# Altium schematic sheet RAM.SchDoc
size A3; SheetNumber: 9; SheetTotal: 14; SPICEModelCachePWQIORAL: <root> / <DocumentId>PWQIORAL</DocumentId> / </root>
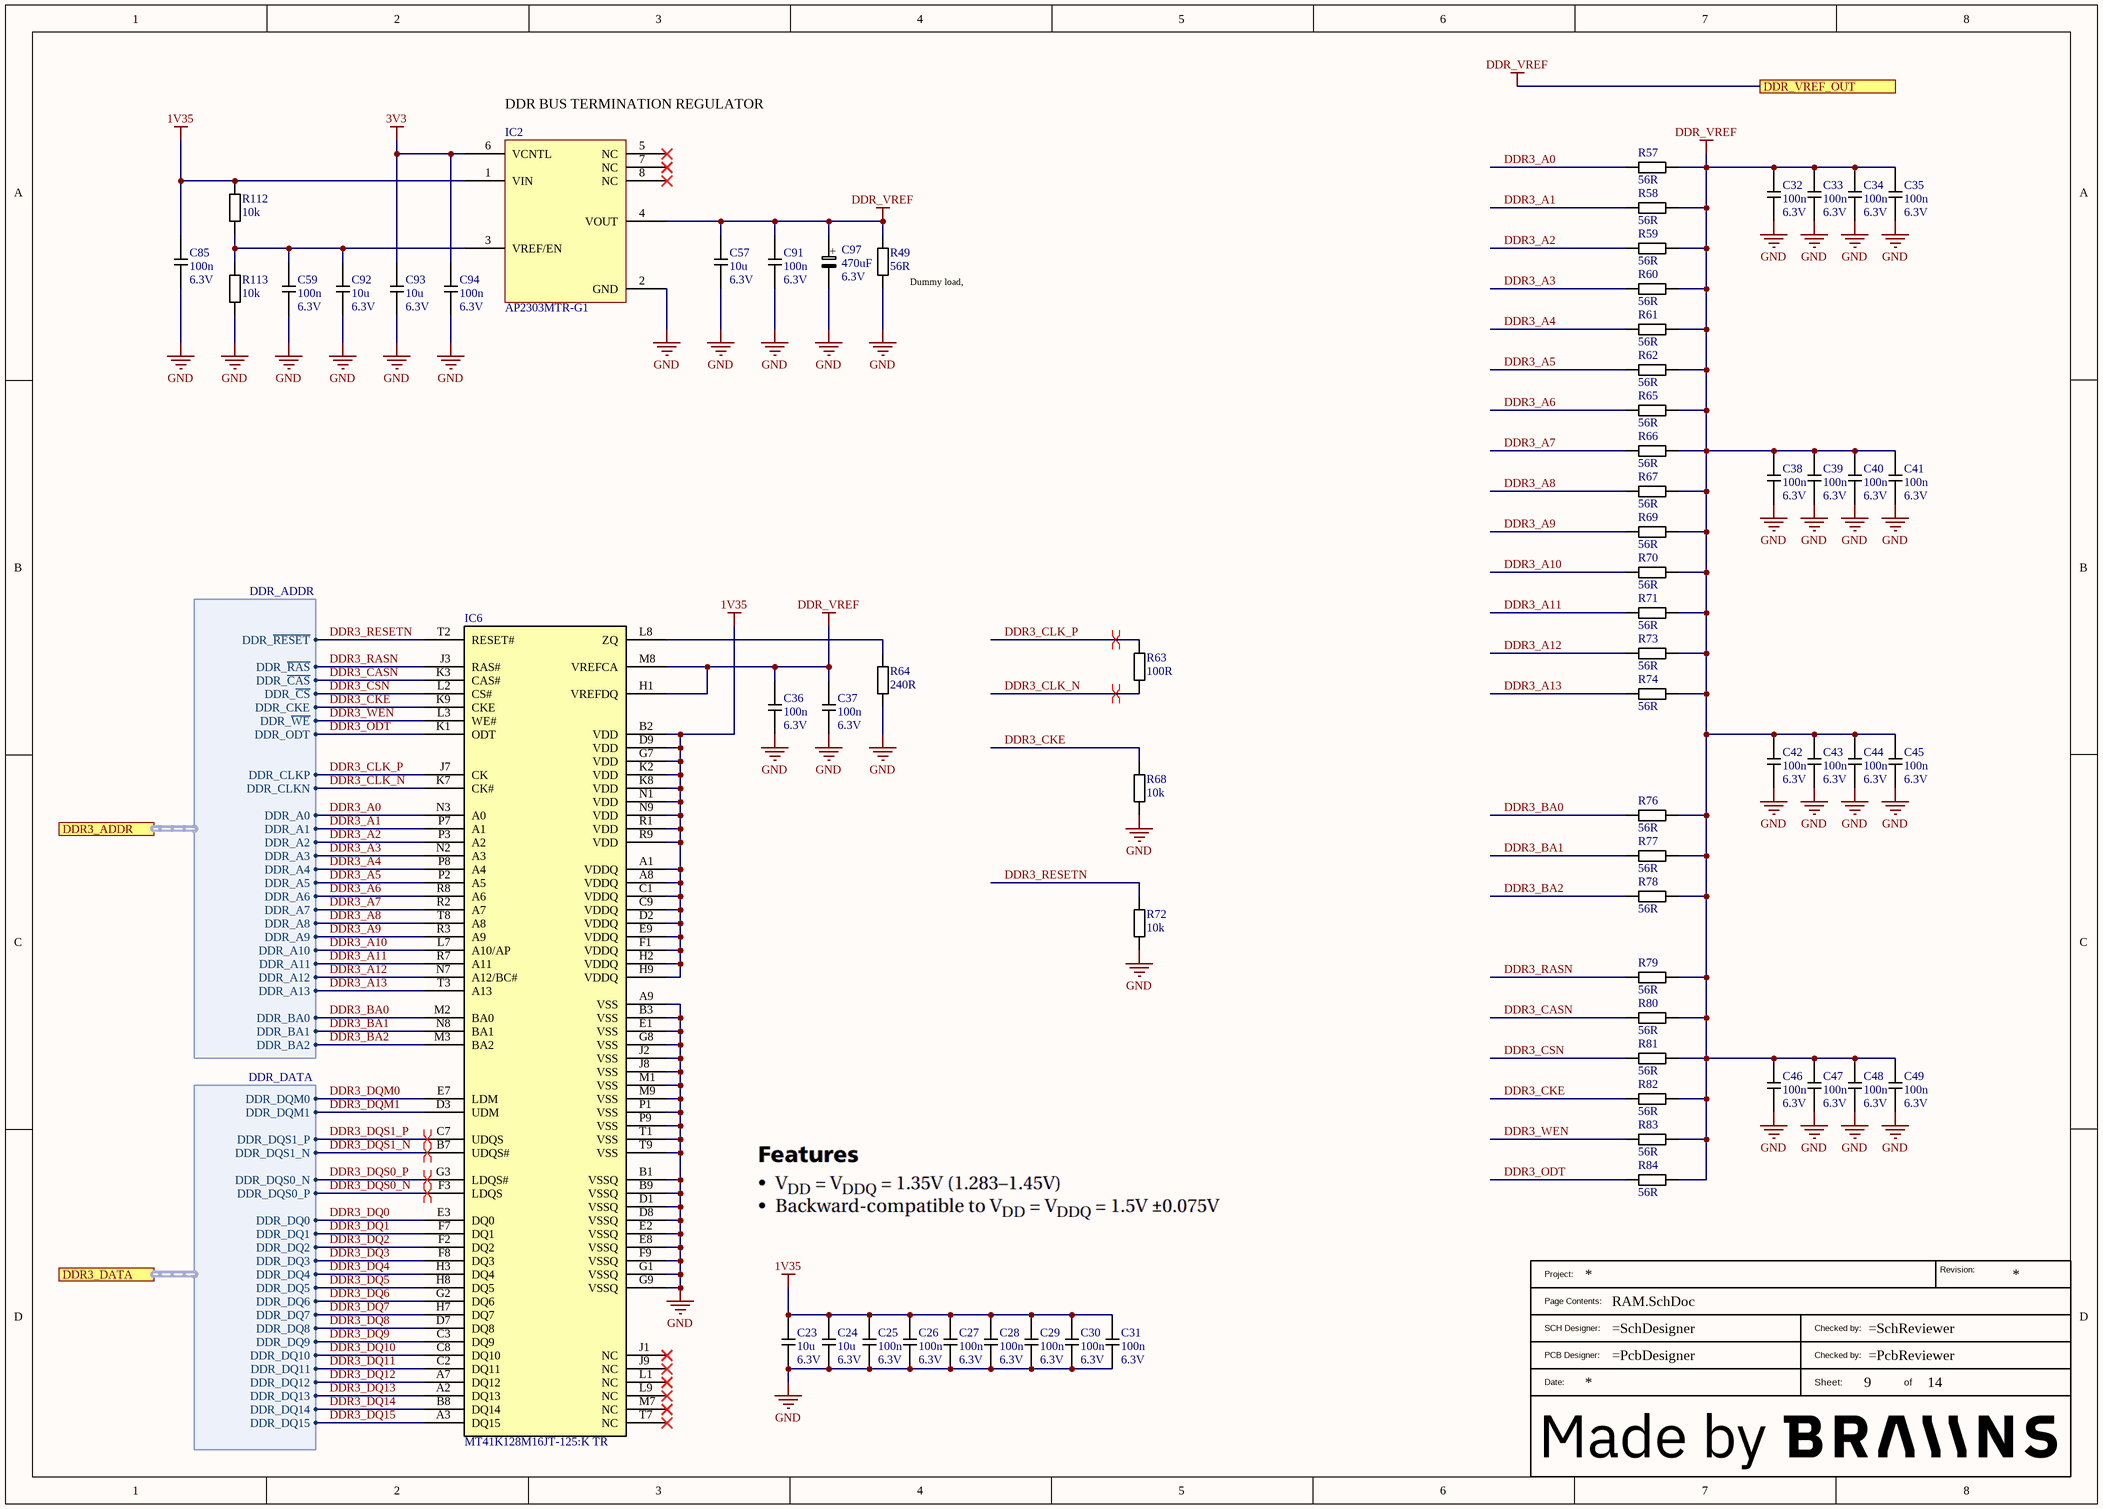
[diagram p0: RAM.SchDoc]

## Parts
?  BraiinsTitleBlockWithLogo  (value not drawn)  (graphical)
C23  Voltage_Rating: 6.3V  [CAP0805]  (hidden comment: 10u)
C24  Voltage_Rating: 6.3V  [CAP0805]  (hidden comment: 10u)
C25  Voltage_Rating: 6.3V  [CAP0402]  (hidden comment: 100n)
C26  Voltage_Rating: 6.3V  [CAP0402]  (hidden comment: 100n)
C27  Voltage_Rating: 6.3V  [CAP0402]  (hidden comment: 100n)
C28  Voltage_Rating: 6.3V  [CAP0402]  (hidden comment: 100n)
C29  Voltage_Rating: 6.3V  [CAP0402]  (hidden comment: 100n)
C30  Voltage_Rating: 6.3V  [CAP0402]  (hidden comment: 100n)
C31  Voltage_Rating: 6.3V  [CAP0402]  (hidden comment: 100n)
C32  Voltage_Rating: 6.3V  [CAP0402]  (hidden comment: 100n)
C33  Voltage_Rating: 6.3V  [CAP0402]  (hidden comment: 100n)
C34  Voltage_Rating: 6.3V  [CAP0402]  (hidden comment: 100n)
C35  Voltage_Rating: 6.3V  [CAP0402]  (hidden comment: 100n)
C36  Voltage_Rating: 6.3V  [CAP0402]  (hidden comment: 100n)
C37  Voltage_Rating: 6.3V  [CAP0402]  (hidden comment: 100n)
C38  Voltage_Rating: 6.3V  [CAP0402]  (hidden comment: 100n)
C39  Voltage_Rating: 6.3V  [CAP0402]  (hidden comment: 100n)
C40  Voltage_Rating: 6.3V  [CAP0402]  (hidden comment: 100n)
C41  Voltage_Rating: 6.3V  [CAP0402]  (hidden comment: 100n)
C42  Voltage_Rating: 6.3V  [CAP0402]  (hidden comment: 100n)
C43  Voltage_Rating: 6.3V  [CAP0402]  (hidden comment: 100n)
C44  Voltage_Rating: 6.3V  [CAP0402]  (hidden comment: 100n)
C45  Voltage_Rating: 6.3V  [CAP0402]  (hidden comment: 100n)
C46  Voltage_Rating: 6.3V  [CAP0402]  (hidden comment: 100n)
C47  Voltage_Rating: 6.3V  [CAP0402]  (hidden comment: 100n)
C48  Voltage_Rating: 6.3V  [CAP0402]  (hidden comment: 100n)
C49  Voltage_Rating: 6.3V  [CAP0402]  (hidden comment: 100n)
C57  Voltage_Rating: 6.3V  [CAP0603]  (hidden comment: 10u)
C59  Voltage_Rating: 6.3V  [CAP0402]  (hidden comment: 100n)
C85  Voltage_Rating: 6.3V  [CAP0402]  (hidden comment: 100n)
C91  Voltage_Rating: 6.3V  [CAP0402]  (hidden comment: 100n)
C92  Voltage_Rating: 6.3V  [CAP0603]  (hidden comment: 10u)
C93  Voltage_Rating: 6.3V  [CAP0603]  (hidden comment: 10u)
C94  Voltage_Rating: 6.3V  [CAP0402]  (hidden comment: 100n)
C97  Voltage_Rating: 6.3V  [CAP_EEEFTJ471XAP]  (hidden comment: 470uF)
IC2  AP2303MTR-G1  [SOIC8]
IC6  MT41K128M16JT-125:K TR  [BGA96C80P9X16_800X1400X120 _0.35]
R49  56R  [RES0402]
R57  56R  [RES0402]
R58  56R  [RES0402]
R59  56R  [RES0402]
R60  56R  [RES0402]
R61  56R  [RES0402]
R62  56R  [RES0402]
R63  100R  [RES0402]
R64  240R  [RES0402]
R65  56R  [RES0402]
R66  56R  [RES0402]
R67  56R  [RES0402]
R68  10k  [RES0402]
R69  56R  [RES0402]
R70  56R  [RES0402]
R71  56R  [RES0402]
R72  10k  [RES0402]
R73  56R  [RES0402]
R74  56R  [RES0402]
R76  56R  [RES0402]
R77  56R  [RES0402]
R78  56R  [RES0402]
R79  56R  [RES0402]
R80  56R  [RES0402]
R81  56R  [RES0402]
R82  56R  [RES0402]
R83  56R  [RES0402]
R84  56R  [RES0402]
R112  10k  [RES0402]
R113  10k  [RES0402]

## Ports
DDR3_ADDR (harness DDR_ADDR), DDR3_DATA (harness DDR_DATA), DDR_VREF_OUT

## Harnesses
DDR_ADDR: DDR_A0, DDR_A1, DDR_A2, DDR_A3, DDR_A4, DDR_A5, DDR_A6, DDR_A7, DDR_A8, DDR_A9, DDR_A10, DDR_A11, DDR_A12, DDR_A13, DDR_BA0, DDR_BA1, DDR_BA2, DDR_CLKP, DDR_CLKN, DDR_~{RAS}, DDR_~{CAS}, DDR_~{CS}, DDR_CKE, DDR_~{WE}, DDR_ODT, DDR_~{RESET}
DDR_DATA: DDR_DQ13, DDR_DQ9, DDR_DQ8, DDR_DQ11, DDR_DQ10, DDR_DQ15, DDR_DQ12, DDR_DQ14, DDR_DQS1_P, DDR_DQS1_N, DDR_DQ5, DDR_DQM1, DDR_DQ6, DDR_DQ2, DDR_DQ1, DDR_DQ3, DDR_DQ0, DDR_DQ4, DDR_DQ7, DDR_DQS0_P, DDR_DQS0_N, DDR_DQM0

## Nets
1V35: C23.1 C24.1 C25.1 C26.1 C27.1 C28.1 C29.1 C30.1 C31.1 C85.1 IC2.1(VIN) IC6.A1(VDDQ) IC6.A8(VDDQ) IC6.B2(VDD) IC6.C1(VDDQ) IC6.C9(VDDQ) IC6.D2(VDDQ) IC6.D9(VDD) IC6.E9(VDDQ) IC6.F1(VDDQ) IC6.G7(VDD) IC6.H2(VDDQ) IC6.H9(VDDQ) IC6.K2(VDD) IC6.K8(VDD) IC6.N1(VDD) IC6.N9(VDD) IC6.R1(VDD) IC6.R9(VDD) R112.1
3V3: C93.1 C94.1 IC2.6(VCNTL)
DDR_VREF: C32.1 C33.1 C34.1 C35.1 C36.1 C37.1 C38.1 C39.1 C40.1 C41.1 C42.1 C43.1 C44.1 C45.1 C46.1 C47.1 C48.1 C49.1 C57.1 C91.1 C97.1 IC2.4(VOUT) IC6.H1(VREFDQ) IC6.M8(VREFCA) R49.2 R57.2 R58.2 R59.2 R60.2 R61.2 R62.2 R65.2 R66.2 R67.2 R69.2 R70.2 R71.2 R73.2 R74.2 R76.2 R77.2 R78.2 R79.2 R80.2 R81.2 R82.2 R83.2 R84.2 ; port DDR_VREF_OUT
GND: C23.2 C24.2 C25.2 C26.2 C27.2 C28.2 C29.2 C30.2 C31.2 C32.2 C33.2 C34.2 C35.2 C36.2 C37.2 C38.2 C39.2 C40.2 C41.2 C42.2 C43.2 C44.2 C45.2 C46.2 C47.2 C48.2 C49.2 C57.2 C59.2 C85.2 C91.2 C92.2 C93.2 C94.2 C97.2 IC2.2(GND) IC6.A9(VSS) IC6.B1(VSSQ) IC6.B3(VSS) IC6.B9(VSSQ) IC6.D1(VSSQ) IC6.D8(VSSQ) IC6.E1(VSS) IC6.E2(VSSQ) IC6.E8(VSSQ) IC6.F9(VSSQ) IC6.G1(VSSQ) IC6.G8(VSS) IC6.G9(VSSQ) IC6.J2(VSS) IC6.J8(VSS) IC6.M1(VSS) IC6.M9(VSS) IC6.P1(VSS) IC6.P9(VSS) IC6.T1(VSS) IC6.T9(VSS) R49.1 R64.1 R68.2 R72.2 R113.2
DDR3_A0: IC6.N3(A0) R57.1 ; port DDR3_ADDR.DDR_A0
DDR3_A1: IC6.P7(A1) R58.1 ; port DDR3_ADDR.DDR_A1
DDR3_A2: IC6.P3(A2) R59.1 ; port DDR3_ADDR.DDR_A2
DDR3_A3: IC6.N2(A3) R60.1 ; port DDR3_ADDR.DDR_A3
DDR3_A4: IC6.P8(A4) R61.1 ; port DDR3_ADDR.DDR_A4
DDR3_A5: IC6.P2(A5) R62.1 ; port DDR3_ADDR.DDR_A5
DDR3_A6: IC6.R8(A6) R65.1 ; port DDR3_ADDR.DDR_A6
DDR3_A7: IC6.R2(A7) R66.1 ; port DDR3_ADDR.DDR_A7
DDR3_A8: IC6.T8(A8) R67.1 ; port DDR3_ADDR.DDR_A8
DDR3_A9: IC6.R3(A9) R69.1 ; port DDR3_ADDR.DDR_A9
DDR3_A10: IC6.L7(A10/AP) R70.1 ; port DDR3_ADDR.DDR_A10
DDR3_A11: IC6.R7(A11) R71.1 ; port DDR3_ADDR.DDR_A11
DDR3_A12: IC6.N7(A12/BC#) R73.1 ; port DDR3_ADDR.DDR_A12
DDR3_A13: IC6.T3(A13) R74.1 ; port DDR3_ADDR.DDR_A13
DDR3_BA0: IC6.M2(BA0) R76.1 ; port DDR3_ADDR.DDR_BA0
DDR3_BA1: IC6.N8(BA1) R77.1 ; port DDR3_ADDR.DDR_BA1
DDR3_BA2: IC6.M3(BA2) R78.1 ; port DDR3_ADDR.DDR_BA2
DDR3_CASN: IC6.K3(CAS#) R80.1 ; port DDR3_ADDR.DDR_~{CAS}
DDR3_CKE: IC6.K9(CKE) R68.1 R82.1 ; port DDR3_ADDR.DDR_CKE
DDR3_CLK_N: IC6.K7(CK#) R63.2 ; port DDR3_ADDR.DDR_CLKN
DDR3_CLK_P: IC6.J7(CK) R63.1 ; port DDR3_ADDR.DDR_CLKP
DDR3_CSN: IC6.L2(CS#) R81.1 ; port DDR3_ADDR.DDR_~{CS}
DDR3_DQ0: IC6.E3(DQ0) ; port DDR3_DATA.DDR_DQ0
DDR3_DQ1: IC6.F7(DQ1) ; port DDR3_DATA.DDR_DQ1
DDR3_DQ2: IC6.F2(DQ2) ; port DDR3_DATA.DDR_DQ2
DDR3_DQ3: IC6.F8(DQ3) ; port DDR3_DATA.DDR_DQ3
DDR3_DQ4: IC6.H3(DQ4) ; port DDR3_DATA.DDR_DQ4
DDR3_DQ5: IC6.H8(DQ5) ; port DDR3_DATA.DDR_DQ5
DDR3_DQ6: IC6.G2(DQ6) ; port DDR3_DATA.DDR_DQ6
DDR3_DQ7: IC6.H7(DQ7) ; port DDR3_DATA.DDR_DQ7
DDR3_DQ8: IC6.D7(DQ8) ; port DDR3_DATA.DDR_DQ8
DDR3_DQ9: IC6.C3(DQ9) ; port DDR3_DATA.DDR_DQ9
DDR3_DQ10: IC6.C8(DQ10) ; port DDR3_DATA.DDR_DQ10
DDR3_DQ11: IC6.C2(DQ11) ; port DDR3_DATA.DDR_DQ11
DDR3_DQ12: IC6.A7(DQ12) ; port DDR3_DATA.DDR_DQ12
DDR3_DQ13: IC6.A2(DQ13) ; port DDR3_DATA.DDR_DQ13
DDR3_DQ14: IC6.B8(DQ14) ; port DDR3_DATA.DDR_DQ14
DDR3_DQ15: IC6.A3(DQ15) ; port DDR3_DATA.DDR_DQ15
DDR3_DQM0: IC6.E7(LDM) ; port DDR3_DATA.DDR_DQM0
DDR3_DQM1: IC6.D3(UDM) ; port DDR3_DATA.DDR_DQM1
DDR3_DQS0_N: IC6.F3(LDQS) ; port DDR3_DATA.DDR_DQS0_P
DDR3_DQS0_P: IC6.G3(LDQS#) ; port DDR3_DATA.DDR_DQS0_N
DDR3_DQS1_N: IC6.B7(UDQS#) ; port DDR3_DATA.DDR_DQS1_N
DDR3_DQS1_P: IC6.C7(UDQS) ; port DDR3_DATA.DDR_DQS1_P
DDR3_ODT: IC6.K1(ODT) R84.1 ; port DDR3_ADDR.DDR_ODT
DDR3_RASN: IC6.J3(RAS#) R79.1 ; port DDR3_ADDR.DDR_~{RAS}
DDR3_RESETN: IC6.T2(RESET#) R72.1 ; port DDR3_ADDR.DDR_~{RESET}
DDR3_WEN: IC6.L3(WE#) R83.1 ; port DDR3_ADDR.DDR_~{WE}
NetC59_1: C59.1 C92.1 IC2.3(VREF/EN) R112.2 R113.1
NetIC6_L8: IC6.L8(ZQ) R64.2

Not connected (* = marked no-connect by the designer): IC2 5(NC)* 7(NC)* 8(NC)*; IC6 J1(NC)* J9(NC)* L1(NC)* L9(NC)* M7(NC)* T7(NC)*

## Layout directives
differential pair: DDR3_CLK_N, DDR3_CLK_P, DDR3_DQS0_N, DDR3_DQS0_P, DDR3_DQS1_N, DDR3_DQS1_P

## Notes on the sheet
- (near IC2) DDR BUS TERMINATION REGULATOR
- (near R49) Dummy load,
- (in symbol 30239) +
- (in symbol BraiinsTitleBlockWithLogo) Revision:; Project:; Page Contents:; SCH Designer:; Checked by:; PCB Designer:; Date:; Sheet:; of

## Library data of the parts
C23 C24 = 30174: CAP CER 10u 10% 6.3V X7R 0805; Part_Type: Capacitor; Part_Status: New; ID: 30174; Updated By: janjuranek; Sorted_Value: 10; Value: 10u; Sub_Type: CER; Manufacturer Part Description: CAP CER 10u 10% 6.3V X7R 0805; Package_Case: 0805; Dielectric: X7R; Tolerance: 10%; Created By: janjuranek; Created_Date: 2023-05-09 02:18:46; Updated_Date: 2023-05-09 02:19:22; ComponentLink1Description: Datasheet; ComponentLink2Description: Supplier Part Details; RoHS: Yes
C25-C49 C59 C85 C91 C94 = 30154: CAP CER 100n 10% 6.3V 0402; Part_Type: Capacitor; Part_Status: New; ID: 30154; Dielectric: X7R; Updated By: janjuranek; Sorted_Value: 100; Value: 100n; Sub_Type: CER; Manufacturer Part Description: CAP CER 100n 10% 6.3V 0402; Package_Case: 0402; RoHS: Yes; Tolerance: 10%; Created By: janjuranek; Created_Date: 2023-05-01 19:17:49; Updated_Date: 2023-05-01 19:19:14; ComponentLink1Description: Datasheet; ComponentLink2Description: Supplier Part Details
C57 C92 C93 = 30139: CAP CER 10u 10% 6.3V 0603 X5R; Part_Type: Capacitor; Part_Status: New; ID: 30139; Updated By: janjuranek; Sorted_Value: 10; Value: 10u; Sub_Type: CER; Manufacturer Part Description: CAP CER 10u 10% 6.3V 0603 X5R; Package_Case: 0603; RoHS: Yes; Dielectric: X5R; Tolerance: 10%; Created By: janjuranek; Created_Date: 2023-04-12 21:40:22; Updated_Date: 2023-04-12 21:42:06; ComponentLink1Description: Datasheet; ComponentLink2Description: Supplier Part Details
C97 = 30239: CAP ELECT 470uF ±20% 6.3V Radial, Can - SMD; Part_Type: Capacitor; Manufacturer Part Number: EEE-FTJ471XAP; Manufacturer: Panasonic Electronic Components; Part_Status: New; ID: 30239; Sub_Type: POL; Updated By: janjuranek; Sorted_Value: 0,00047; Value: 470uF; Manufacturer Part Description: CAP ELECT 470uF ±20% 6.3V Radial, Can - SMD; Supplier 1: Digi-Key; Supplier Part Number 1: P15096TR-ND; Package_Case: Radial, Can - SMD; RoHS: Yes; Temperature Range: -55C to +105C; Tolerance: ±20%; Created By: janjuranek; Created_Date: 2023-10-13 11:39:12; Updated_Date: 2023-10-13 11:39:46; ComponentLink1Description: Datasheet; ComponentLink2Description: Supplier Part Details; ComponentLink2URL: https://www.digikey.com/products/en?keywords=EEE-FTJ471XAP
IC2 = 30185: IC REG CONV DDR 1OUT 8SOIC; Manufacturer: Diodes Incorporated; Part_Status: New; ID: 30185; Updated By: janjuranek; Value: AP2303MTR-G1; Part_Type: IC; Manufacturer Part Number: AP2303MTR-G1; Manufacturer Part Description: IC REG CONV DDR 1OUT 8SOIC; Supplier 1: Digi-Key; Supplier Part Number 1: AP2303MTR-G1DITR-ND; Package_Case: SOIC8; RoHS: Yes; Temperature Range: -40C to +85C; Created By: janjuranek; Created_Date: 2023-05-23 03:56:05; Updated_Date: 2023-05-23 04:00:42; ComponentLink1Description: Datasheet; ComponentLink2Description: Supplier Part Details; ComponentLink2URL: https://www.digikey.com/products/en?keywords=AP2303MTR-G1
IC6 = 30135: IC DRAM 2GBIT PARALLEL 96FBGA; Manufacturer: Micron Technology Inc.; Part_Status: New; ID: 30135; Updated By: janjuranek; Value: MT41K128M16JT-125:K TR; Part_Type: IC; Manufacturer Part Number: MT41K128M16JT-125:K TR; Manufacturer Part Description: IC DRAM 2GBIT PARALLEL 96FBGA; Supplier 1: Digi-Key; Supplier Part Number 1: MT41K128M16JT-125:KTR-ND; Package_Case: 96-TFBGA; RoHS: Yes; Temperature Range: 0C to +95C (TC); Created By: janjuranek; Created_Date: 2023-04-11 10:23:31; Updated_Date: 2023-05-04 17:49:41; ComponentLink1Description: Datasheet; ComponentLink2Description: Supplier Part Details; ComponentLink2URL: https://www.digikey.com/products/en?keywords=MT41K128M16JT-125:K TR
R49 R57-R62 R65-R67 R69-R71 R73 R74 R76-R84 = 30143: RES 56R Ohm 1% 0402; Part_Status: New; ID: 30143; Updated By: janjuranek; Sorted_Value: 56; Value: 56R; Part_Type: Resistor; Manufacturer Part Description: RES 56R Ohm 1% 0402; Package_Case: 0402; RoHS: Yes; Tolerance: 1%; Created By: janjuranek; Created_Date: 2023-04-13 01:07:23; Updated_Date: 2023-04-13 01:07:42; ComponentLink1Description: Datasheet; ComponentLink2Description: Supplier Part Details
R63 = 30142: RES 100R Ohm 1% 0402; Part_Status: New; ID: 30142; Updated By: janjuranek; Sorted_Value: 100; Value: 100R; Part_Type: Resistor; Manufacturer Part Description: RES 100R Ohm 1% 0402; Package_Case: 0402; RoHS: Yes; Tolerance: 1%; Created By: janjuranek; Created_Date: 2023-04-13 00:40:40; Updated_Date: 2023-04-13 00:41:13; ComponentLink1Description: Datasheet; ComponentLink2Description: Supplier Part Details
R64 = 30141: RES 240R Ohm 1% 0402; Part_Status: New; ID: 30141; Updated By: janjuranek; Sorted_Value: 240; Value: 240R; Part_Type: Resistor; Manufacturer Part Description: RES 240R Ohm 1% 0402; Package_Case: 0402; RoHS: Yes; Tolerance: 1%; Created By: janjuranek; Created_Date: 2023-04-13 00:40:15; Updated_Date: 2023-04-13 00:40:34; ComponentLink1Description: Datasheet; ComponentLink2Description: Supplier Part Details
R68 R72 = 30071: RES 10k Ohm 1% 0402; Part_Status: New; ID: 30071; Updated By: Jan; Sorted_Value: 10000; Value: 10k; Part_Type: Resistor; Manufacturer Part Description: RES 10k Ohm 1% 0402; Package_Case: 0402; RoHS: Yes; Temperature Range: -40 to +150C; Tolerance: 1%; Created By: Jan; Created_Date: 2023-03-02 13:13:56; Updated_Date: 2023-03-02 13:14:31; ComponentLink1Description: Datasheet; ComponentLink2Description: Supplier Part Details
R112 R113 = 30177: RES 10k Ohm 0.1% 0402; Part_Status: New; ID: 30177; Updated By: janjuranek; Sorted_Value: 10000; Value: 10k; Part_Type: Resistor; Manufacturer Part Description: RES 10k Ohm 0.1% 0402; Package_Case: 0402; RoHS: Yes; Tolerance: 0.1%; Created By: janjuranek; Created_Date: 2023-05-09 11:07:54; Updated_Date: 2023-05-09 11:08:21; ComponentLink1Description: Datasheet; ComponentLink2Description: Supplier Part Details